# EAGLE design LCD_Shield (EAGLE 5.10)
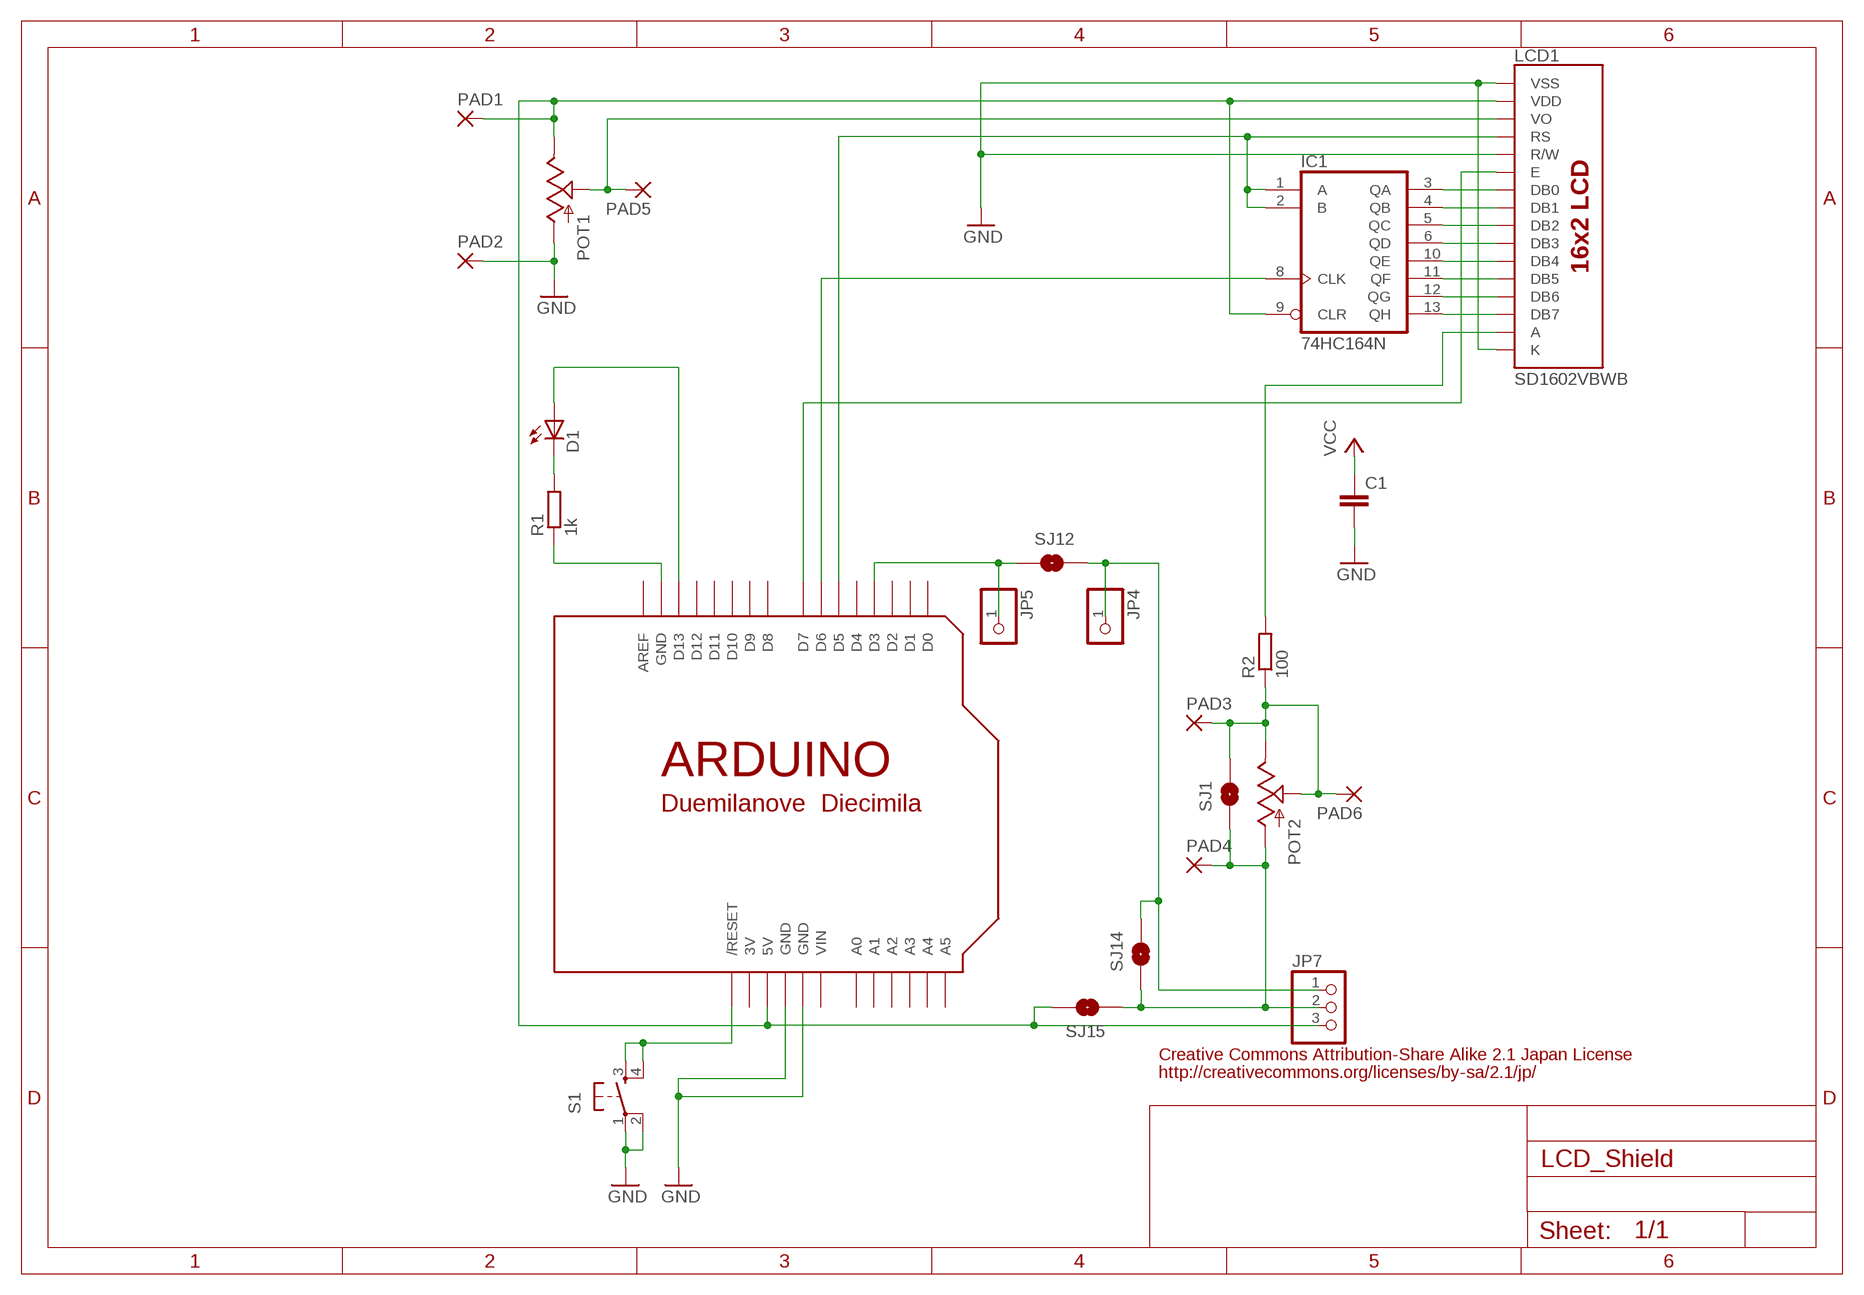
[diagram p0: schematic, sheet 1]

## Parts
C1  C-EU025-024X044  [C025-024X044]
D1  LED3MM  [LED3MM]
IC1  74HC164N  [DIL14]
JP4  PINHD-1X1  [1X01]
JP5  PINHD-1X1  [1X01]
JP7  PINHD-1X3CB  [1X03-CLEANBIG]
LCD1  SD1602VBWB  [SD1602VBWB]
PAD1  1,6/0,8  [1,6/0,8]
PAD2  1,6/0,8  [1,6/0,8]
PAD3  1,6/0,8  [1,6/0,8]
PAD4  1,6/0,8  [1,6/0,8]
PAD5  1,6/0,8  [1,6/0,8]
PAD6  1,6/0,8  [1,6/0,8]
POT1  POTTRIM  [TRIM_POT]
POT2  POTTRIM  [TRIM_POT]
R1  1k  R-EU_0204/7  [0204/7]
R2  100  R-EU_0204/7  [0204/7]
S1  TAC_SWITCHPTH  [TACTILE-PTH]
SJ1  SOLDERJUMPERNO  [SJ_2S-NO]
SJ12  SOLDERJUMPERNO  [SJ_2S-NO]
SJ14  SOLDERJUMPERNO  [SJ_2S-NO]
SJ15  SOLDERJUMPERNO  [SJ_2S-NO]
U$1  ARDUINODUEMILANOVE-NOHOLES  [ARDUINO-NOHOLE]

## Nets
GND: C1.2 LCD1.P$01(VSS) LCD1.P$05(R/W) LCD1.P$16(K) PAD2.1(P) POT1.3(A) S1.1 S1.2 U$1.GND1(GND) U$1.GND2(GND)
N$1: D1.K(C) R1.2
N$2: R1.1 U$1.GND
N$3: JP5.1 SJ12.1 U$1.D3
N$4: JP4.1 JP7.1 SJ12.2 SJ14.2
N$5: IC1.1(A) IC1.2(B) LCD1.P$04(RS) U$1.D5
N$6: IC1.8(CLK) U$1.D6
N$7: LCD1.P$06(E) U$1.D7
N$8: LCD1.P$15(A) R2.2
N$14: D1.A U$1.D13
N$15: PAD3.1(P) PAD6.1(P) POT2.1(S) POT2.2(E) R2.1 SJ1.2
N$29: JP7.2 PAD4.1(P) POT2.3(A) SJ1.1 SJ14.1 SJ15.1
N$31: S1.3 S1.4 U$1.RESET(/RESET)
N$32: IC1.3(QA) LCD1.P$07(DB0)
N$33: IC1.4(QB) LCD1.P$08(DB1)
N$34: LCD1.P$03(VO) PAD5.1(P) POT1.1(S)
N$35: IC1.5(QC) LCD1.P$09(DB2)
N$36: IC1.6(QD) LCD1.P$10(DB3)
N$37: IC1.10(QE) LCD1.P$11(DB4)
N$38: IC1.11(QF) LCD1.P$12(DB5)
N$39: IC1.12(QG) LCD1.P$13(DB6)
N$40: IC1.13(QH) LCD1.P$14(DB7)
VCC: C1.1 IC1.9(CLR) JP7.3 LCD1.P$02(VDD) PAD1.1(P) POT1.2(E) SJ15.2 U$1.5V
Unconnected: U$1.A0 U$1.A1 U$1.A2 U$1.A3 U$1.A4 U$1.A5 U$1.AREF U$1.D0 U$1.D1 U$1.D2 U$1.D4 U$1.D8 U$1.D9 U$1.D10 U$1.D11 U$1.D12

## Notes on the sheet
- Creative Commons Attribution-Share Alike 2.1 Japan License
- http://creativecommons.org/licenses/by-sa/2.1/jp/

## Power pins joined to a net without a drawn wire
3V: U$1.3V
GND: IC1.7(GND)
VCC: IC1.14(VCC)
VIN: U$1.VIN

## Library data of the parts
C1 = rcl:C-EU: CAPACITOR, European symbol
D1 = SparkFun:LED: LEDs Standard schematic elements and footprints for 5mm, 3mm, 1206, and 0603 sized LEDs. 5mm - Spark Fun Electronics SKU : COM-00529 (and others)
IC1 = 74xx-us:74*164: 8-bit parallel out SHIFT REGISTER
JP4 JP5 = pinhead:PINHD-1X1: PIN HEADER
JP7 = adafruit:PINHD-1X3: PIN HEADER
LCD1 = SUNLIKE_LCD_SD1602:SD1602VBWB
PAD1-PAD6 = wirepad:1,6/0,8: THROUGH-HOLE PAD
POT1 POT2 = SparkFun:POT
R1 R2 = rcl:R-EU_: RESISTOR, European symbol
S1 = SparkFun:TAC_SWITCH: Momentary Switch Button commonly used for reset or general input. Spark Fun Electronics SKU : COM-00097
SJ1 SJ12 SJ14 SJ15 = SparkFun:SOLDERJUMPER: Solder Jumper Standard SMD solder jumper. Used to automate production. Two varients : Normally Open and Normally Closed are the same, but have different paste layers. NC will have a large amount of paste and should jumper during reflow.
U$1 = adafruit:ARDUINO: Arduino Diecimila/Duemilanove Make a shield with ease, this package has all the named pins as well as the two mounting drill holes and an outline of the USB and DC power connector. The outline is on the DIMENSION layer, so if your board house uses it they will cut the outline to match. http://www.ladyada.net/library/pcb/eaglelibrary.html

## Board
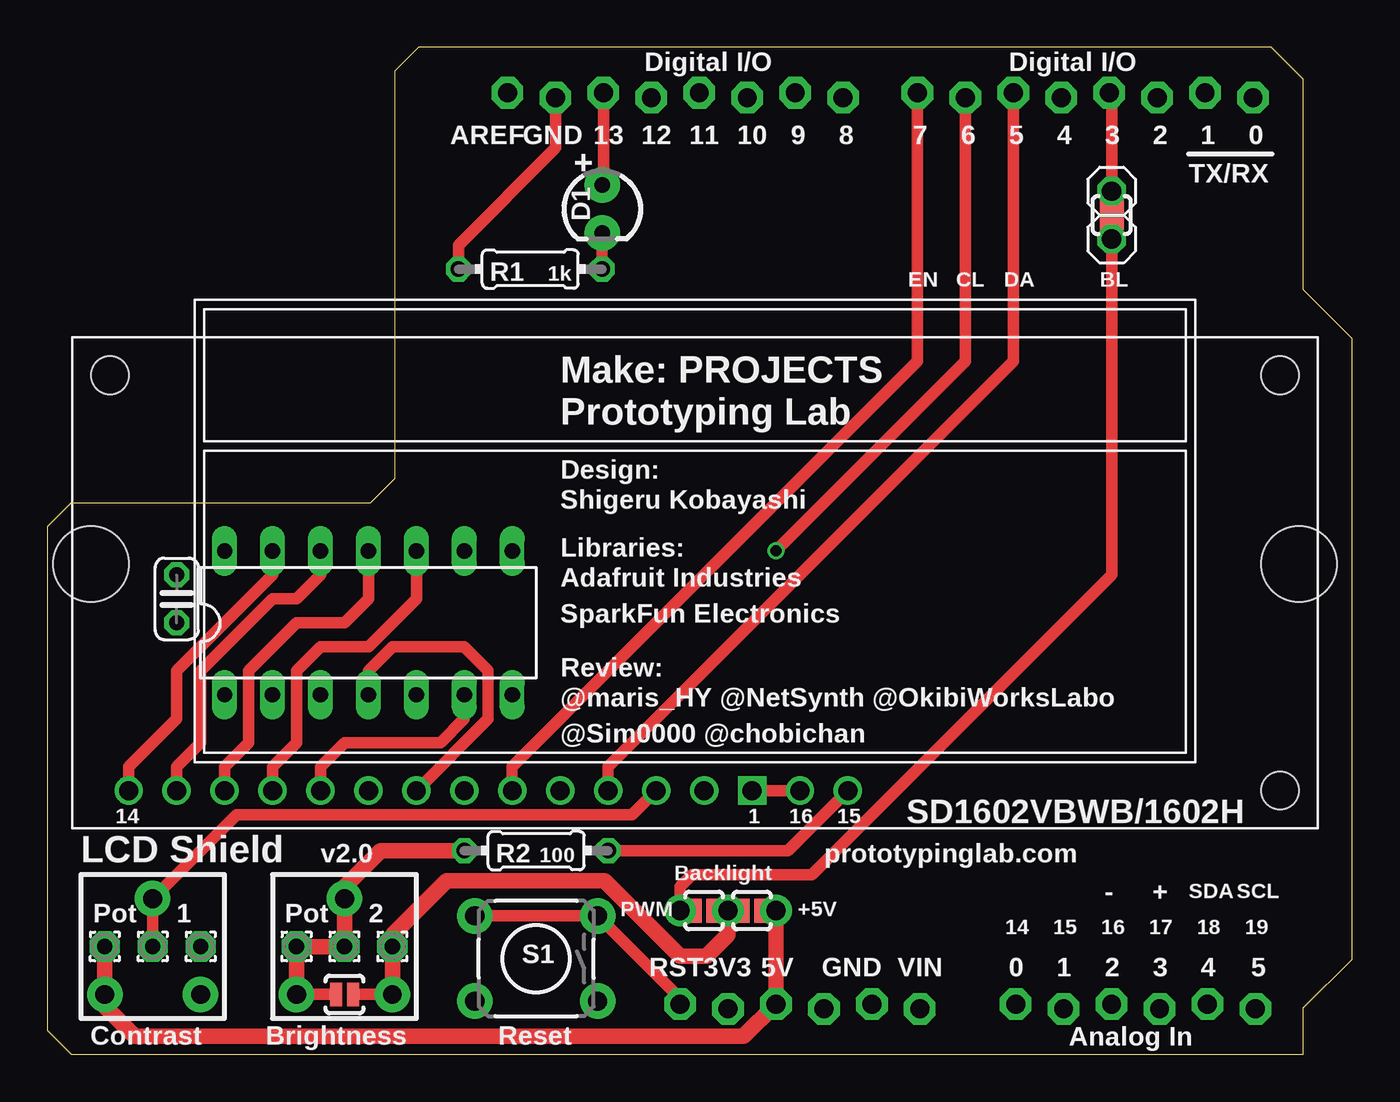
[diagram p1: board, top side]
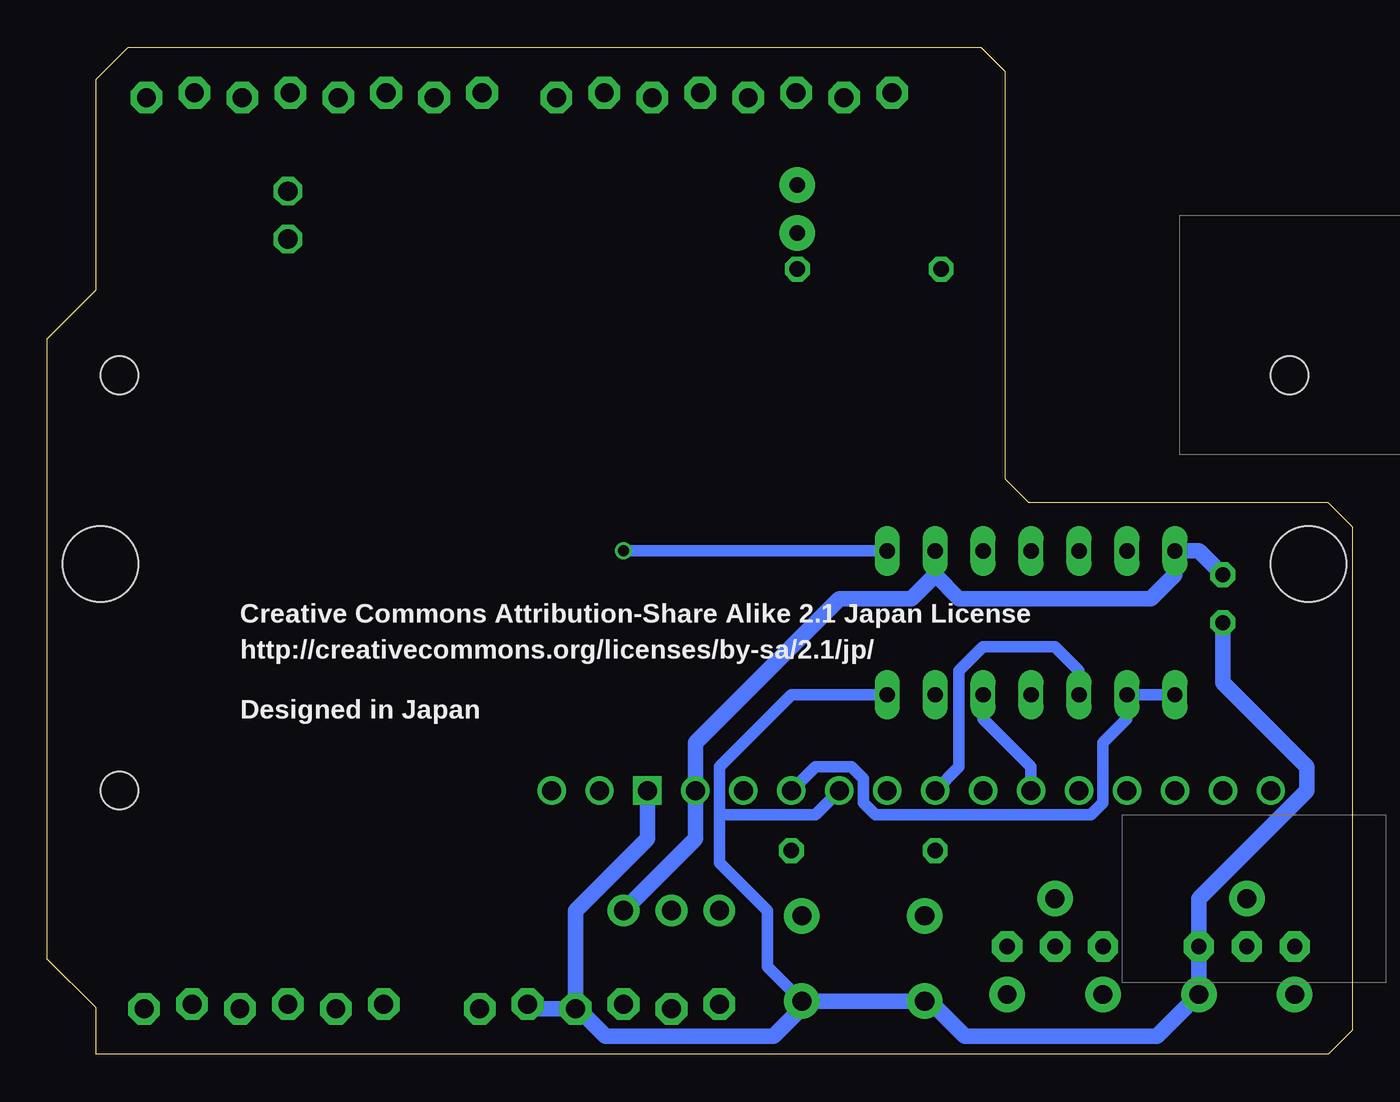
[diagram p2: board, bottom side, seen from below]

Size 69.14 x 53.34 mm. Coordinates in mm from the lower left corner, seen from the top.
Copper layers (1*16): Top 0.035mm / dielectric 1.5mm / Bottom 0.035mm
Design rules "Fusion_eagle_rule_v1.1 *": minimum track width 6mil, minimum drill 12mil, track to track 6mil, track to pad 6mil, pad to pad 6mil, via to via 6mil, smd to smd 0mil, copper to edge 10mil, drill to drill 10mil, minimum pad ring 10mil, minimum via ring 6mil, stop-mask expansion 2mil, vias tented up to drill 100mil, thermal gap 10mil

### Footprints (pad centres in the part's own frame; a part is rotated, then mirrored left to right if it is on the bottom)
C025-024X044 = drill 0.813 octagon: 1 -1.27,0; 2 1.27,0
LED3MM = drill 0.813 pad 1.88 round: A -1.27,0; K 1.27,0
DIL14 = drill 0.813 long: 1 -7.62,-3.81; 2 -5.08,-3.81; 3 -2.54,-3.81; 4 0,-3.81; 5 2.54,-3.81; 6 5.08,-3.81; 7 7.62,-3.81; 8 7.62,3.81; 9 5.08,3.81; 10 2.54,3.81; 11 0,3.81; 12 -2.54,3.81; 13 -5.08,3.81; 14 -7.62,3.81
1X01 = drill 1.016 octagon: 1 0,0
1X03-CLEANBIG = drill 1.016 pad 1.676 round: 1 -2.54,0; 2 0,0; 3 2.54,0
SD1602VBWB = drill 1 square: P$01 33.02,0 | drill 1 round: P$02 30.48,0; P$03 27.94,0; P$04 25.4,0; P$05 22.86,0; P$06 20.32,0; P$07 17.78,0; P$08 15.24,0; P$09 12.7,0; P$10 10.16,0; P$11 7.62,0; P$12 5.08,0; P$13 2.54,0; P$14 0,0; P$15 38.1,0; P$16 35.56,0 | hole 4: -2,12; 62,12 | hole 2: -1,22; 61,22; 61,0
1,6/0,8 = drill 0.813 pad 1.6 octagon: 1 0,0
TRIM_POT = drill 1 pad 1.88 round: 1 5.08,0; 2 0,2.54; 3 0,-2.54
0204/7 = drill 0.813 octagon: 1 -3.81,0; 2 3.81,0
TACTILE-PTH = drill 1.016 pad 1.88 round: 1 -3.251,2.261; 2 3.251,2.261; 3 -3.251,-2.261; 4 3.251,-2.261
SJ_2S-NO = smd 0.635 x 1.27: 1 -0.45,0; 2 0.45,0
ARDUINO-NOHOLE = drill 1 pad 1.676 octagon: 3V 36.068,2.413; 5V 38.608,2.667; A0 51.308,2.667; A1 53.848,2.413; A2 56.388,2.667; A3 58.928,2.413; A4 61.468,2.667; A5 64.008,2.413; AREF 24.384,50.927; D0 63.881,50.673; D1 61.341,50.927; D2 58.801,50.673; D3 56.261,50.927; D4 53.721,50.673; D5 51.181,50.927; D6 48.641,50.673; D7 46.101,50.927; D8 42.164,50.673; D9 39.624,50.927; D10 37.084,50.673; D11 34.544,50.927; D12 32.004,50.673; D13 29.464,50.927; GND 26.924,50.673; GND1 43.688,2.667; GND2 41.148,2.413; RESET 33.528,2.667; VIN 46.228,2.413

### Placement (x,y rotation side)
C1  6.86,24.13 270 top
D1  29.4,44.77 270 top
IC1  17.02,22.86 0 top
JP4  56.39,43.18 0 top
JP5  56.39,45.72 0 top
JP7  36.07,7.62 0 top
LCD1  4.32,13.97 0 top
PAD1  3.05,5.71 0 top
PAD2  8.13,5.71 0 top
PAD3  13.21,5.71 0 top
PAD4  18.29,5.71 0 top
PAD5  5.59,5.71 0 top
PAD6  15.75,5.71 0 top
POT1  5.59,3.18 90 top
POT2  15.75,3.18 90 top
R1  25.59,41.59 0 top
R2  25.91,10.79 0 top
S1  25.91,5.08 180 top
SJ1  15.75,3.18 180 top
SJ12  56.39,44.45 270 top
SJ14  34.8,7.62 180 top
SJ15  37.34,7.62 0 top
U$1  0,0 0 top

### Tracks (layer width: path | path; a pad name or v marks a point on that pad's centre or on a via)
GND
  Top 0.61: LCD1.P$01 LCD1.P$16
  Bottom 0.61: 22.38,2.82 S1.2 | 41.02,2.41 U$1.GND2 | IC1.7 29.72,19.05 33.53,15.24 33.53,12.7 | 33.53,12.7 33.53,10.16 30.99,7.62 30.99,4.65 S1.1 | LCD1.P$05 28.45,12.7 33.53,12.7
  Bottom 0.813: LCD1.P$01 37.34,11.43 41.15,7.62 U$1.GND2 43.43,2.41 U$1.GND1 | S1.2 S1.1 29.16,2.46 30.67,0.95 39.56,0.95 41.02,2.41 | 22.38,2.82 20.51,0.95 10.35,0.95 POT1.3 PAD2.1 8.13,8.26 2.41,13.97 2.41,15.24 6.86,19.68 C1.2
N$1
  Top 0.61: R1.2 D1.K
N$2
  Top 0.61: R1.1 21.78,42.86 26.92,48.01 U$1.GND
N$3
  Top 0.61: U$1.D3 56.39,50.8 JP5.1 SJ12.1
N$4
  Top 0.61: SJ12.2 JP4.1 56.39,25.4 40.51,9.53 34.16,9.53 33.53,8.89 JP7.1 SJ14.2
N$5
  Top 0.61: U$1.D5 51.18,36.7 29.72,15.24 LCD1.P$04
  Bottom 0.61: IC1.1 IC1.2 11.94,17.78 13.21,16.51 13.21,13.34 13.84,12.7 25.27,12.7 25.91,13.34 25.91,14.61 26.54,15.24 28.45,15.24 LCD1.P$04
N$6  (via drill 0.6)
  Top 0.61: U$1.D6 48.64,36.7 v38.61,26.67
  Bottom 0.61: IC1.8 v38.61,26.67
N$7
  Top 0.61: U$1.D7 46.1,36.7 24.64,15.24 LCD1.P$06
N$8
  Top 0.61: R2.2 39.24,10.79 LCD1.P$15
N$14
  Top 0.61: U$1.D13 29.46,46.1 D1.A
N$15
  Top 0.61: POT2.2 SJ1.2
  Top 0.813: POT2.2 PAD3.1 PAD6.1 POT2.1 15.75,8.89 17.65,10.79 R2.1
N$29
  Top 0.61: SJ1.1 POT2.3 | PAD4.1 18.29,6.35 | SJ15.1 JP7.2 SJ14.1
  Top 0.813: POT2.3 PAD4.1 | 18.29,6.35 21.14,9.21 29.53,9.21 33.53,5.21 34.92,5.21 36.07,6.35 JP7.2
N$31
  Top 0.61: S1.4 S1.3 33.53,2.97 U$1.RESET
N$32
  Bottom 0.61: LCD1.P$07 20.83,15.24 20.83,20.32 19.56,21.59 15.75,21.59 14.48,20.32 IC1.3
N$33
  Top 0.61: LCD1.P$08 23.37,17.78 23.37,20.32 22.1,21.59 18.29,21.59 17.02,20.32 IC1.4
N$34
  Top 0.61: LCD1.P$03 30.99,12.7 10.03,12.7 POT1.1 PAD5.1
N$35
  Bottom 0.61: LCD1.P$09 17.02,15.24 19.56,17.78 IC1.5
N$36
  Top 0.61: LCD1.P$10 14.48,15.24 15.75,16.51 20.83,16.51 22.1,17.78 IC1.6
N$37
  Top 0.61: LCD1.P$11 11.94,15.24 13.21,16.51 13.21,20.32 14.48,21.59 17.02,21.59 19.56,24.13 IC1.10
N$38
  Top 0.61: LCD1.P$12 9.4,15.24 10.67,16.51 10.67,20.32 13.21,22.86 15.75,22.86 17.02,24.13 IC1.11
N$39
  Top 0.61: LCD1.P$13 6.86,15.24 8.13,16.51 8.13,20.32 11.94,24.13 13.21,24.13 14.48,25.4 IC1.12
N$40
  Top 0.61: IC1.13 11.94,25.4 6.86,20.32 6.86,17.78 4.32,15.24 LCD1.P$14
VCC
  Top 0.61: JP7.3 SJ15.2
  Top 0.813: PAD1.1 POT1.2 3.05,2.54 4.63,0.95 36.89,0.95 U$1.5V | U$1.5V 38.48,2.67 | U$1.5V JP7.3
  Bottom 0.813: JP7.3 34.8,11.43 LCD1.P$02 34.8,16.51 27.18,24.13 23.37,24.13 22.1,25.4 | 22.1,25.4 IC1.9 | C1.1 8.13,26.67 IC1.14 9.4,25.4 10.67,24.13 20.83,24.13 22.1,25.4

### Text on the board
tPlace: Contrast | Brightness
tNames: + | TX/RX | EN | CL | DA | BL | Make: PROJECTS | Prototyping Lab | Design: | Shigeru Kobayashi | Libraries: | Adafruit Industries | SparkFun Electronics | Review: | @maris_HY @NetSynth @OkibiWorksLabo | @Sim0000 @chobichan | LCD Shield | v2.0 | prototypinglab.com | Backlight | SDA | SCL | PWM | +5V | - | + | Pot | 1 | Pot | 2 | 14 | 15 | 16 | 17 | 18 | 19 | Reset
bNames: Creative Commons Attribution-Share Alike 2.1 Japan License | http://creativecommons.org/licenses/by-sa/2.1/jp/ | Designed in Japan